# Altium project MecaVac.PrjPcb
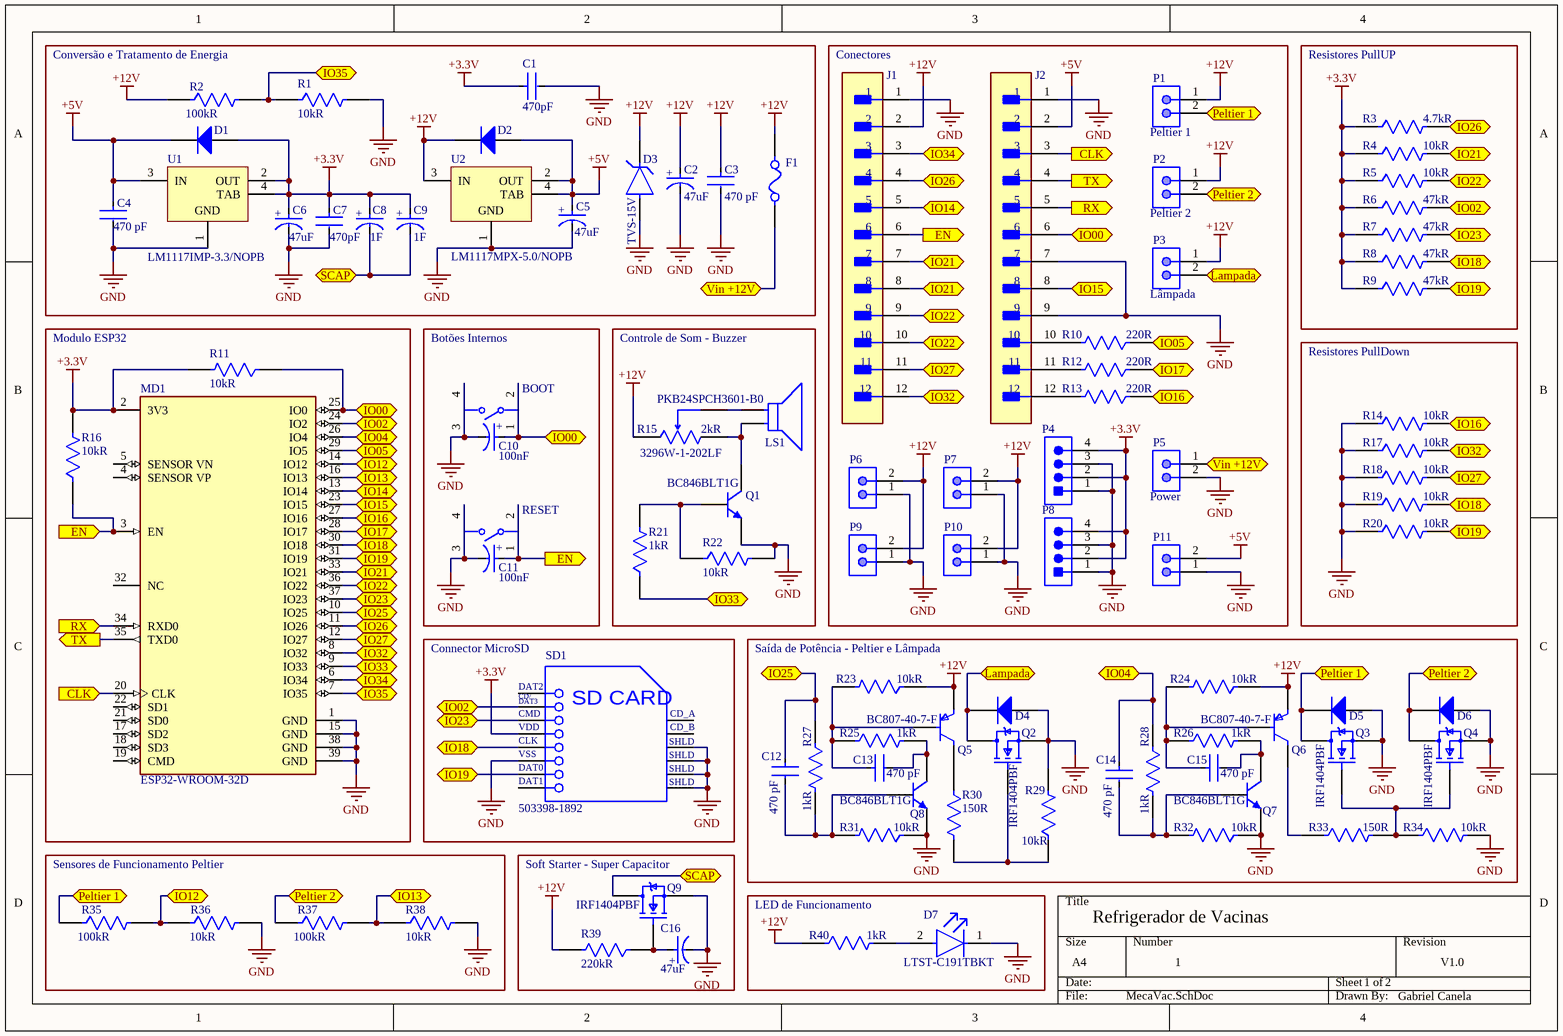
[diagram p0: MecaVac.SchDoc]
Designer: Gabriel Canela; File: MecaVac/main.SchDoc; Start Date: 03/11/2022
1 sheet, 93 parts. Net scope: flat (ports and power ports of the same name join across sheets).
Board file: MecaVac.PcbDoc

## Sheet MecaVac.SchDoc: Refrigerador de Vacinas
size A4; Date: 03/11/2022; Author: Gabriel Canela; CompanyName: Mecatron; DrawnBy: Gabriel Canela; DocumentNumber: 1; Revision: V1.0; SheetNumber: 1; SheetTotal: 2; SPICEModelCacheOFBBGRMV: <root> / <DocumentId>OFBBGRMV</DocumentId> / </root>; Power: Conversão e Tratamento de Energia; CPU: Modulo ESP32; potencia: Saída de Potência - Peltier e Lâmpada; Buzzer: Controle de Som - Buzzer; botoes: Botões Internos; Corrente: Sensores de Funcionamento Peltier; SD: Connector MicroSD; Conectores: Conectores; ResPullUp: Resistores PullUP; ResPullDown: Resistores PullDown; LED: LED de Funcionamento; SuperCorrente: Soft Starter - Super Capacitor

### Parts
C1  Capacitancia: 470pF  [FP-C0603C-CF-MFG]  (hidden comment: C0603C471J5GACTU)
C2  Capacitance: 47uF  [FP-T491D476K025AT-MFG]  (hidden comment: T491D476K025AT)
C3  Capacitance: 470 pF  [FP-C0603C-CF-MFG]  (hidden comment: C0603C471J5GACTU)
C4  Capacitance: 470 pF  [FP-C0603C-CF-MFG]  (hidden comment: C0603C471J5GACTU)
C5  47uF  [FP-TAJD-MFG]
C6  47uF  [FP-TAJD-MFG]
C7  Capacitancia: 470pF  [FP-C0603C-CF-MFG]  (hidden comment: C0603C471J5GACTU)
C8  value 1F  [FP-FR0H105ZF-MFG]  (hidden comment: Super Capacitor 1F 5.5V)
C9  1F  [FP-FR0H105ZF-MFG]
C10  Capacitance: 100nF  [FP-TAJA-MFG]  (hidden comment: TAJA104K035RNJ)
C11  Capacitance: 100nF  [FP-TAJA-MFG]  (hidden comment: TAJA104K035RNJ)
C12  Capacitance: 470 pF  [FP-C0603C-CF-MFG]  (hidden comment: C0603C471J5GACTU)
C13  Capacitance: 470 pF  [FP-C0603C-CF-MFG]  (hidden comment: C0603C471J5GACTU)
C14  Capacitance: 470 pF  [FP-C0603C-CF-MFG]  (hidden comment: C0603C471J5GACTU)
C15  Capacitance: 470 pF  [FP-C0603C-CF-MFG]  (hidden comment: C0603C471J5GACTU)
C16  Capacitance: 47uF  [FP-T491D476K025AT-MFG]  (hidden comment: T491D476K025AT)
D1  BAT54HT1G  [ONSC-SOD-323-2-477-02_V]  (value not drawn)
D2  BAT54HT1G  [ONSC-SOD-323-2-477-02_V]  (value not drawn)
D3  TVS-15V  [FP-95401-MFG]
D4  BAT54HT1G  [ONSC-SOD-323-2-477-02_V]  (value not drawn)
D5  BAT54HT1G  [ONSC-SOD-323-2-477-02_V]  (value not drawn)
D6  BAT54HT1G  [ONSC-SOD-323-2-477-02_V]  (value not drawn)
D7  LTST-C191TBKT  [FP-LTST-C191TBKT-MFG]
F1  64600001223  [FP-64600001223-MFG]  (value not drawn)
J1  22-27-2121  [FP-22-27-2121-MFG]  (value not drawn)
J2  22-27-2121  [FP-22-27-2121-MFG]  (value not drawn)
LS1  PKB24SPCH3601-B0  [FP-PKB24SPCH3601-B0-MFG]
MD1  ESP32-WROOM-32D  [FP-ESP32-WROOM-32D-MFG]
P1  Peltier 1  [PHOE-1803426_V]
P2  Peltier 2  [PHOE-1803426_V]
P3  Lâmpada  [PHOE-1803426_V]
P4  22-27-2041  [MOLX-22-27-2041_V]  (value not drawn)
P5  Power  [PHOE-1803426_V]
P6  22-27-2021  [MOLX-22-27-2021_V]  (value not drawn)
P7  22-27-2021  [MOLX-22-27-2021_V]  (value not drawn)
P8  22-27-2041  [MOLX-22-27-2041_V]  (value not drawn)
P9  22-27-2021  [MOLX-22-27-2021_V]  (value not drawn)
P10  22-27-2021  [MOLX-22-27-2021_V]  (value not drawn)
P11  22-27-2021  [MOLX-22-27-2021_V]  (value not drawn)
Q1  BC846BLT1G  [ONSC-SOT-23-3-318-08_V]
Q2  IRF1404PBF  [FP-PG-TO220-3-MFG]
Q3  IRF1404PBF  [FP-PG-TO220-3-MFG]
Q4  IRF1404PBF  [FP-PG-TO220-3-MFG]
Q5  BC807-40-7-F  [FP-SOT23-MFG]
Q6  BC807-40-7-F  [FP-SOT23-MFG]
Q7  BC846BLT1G  [ONSC-SOT-23-3-318-08_V]
Q8  BC846BLT1G  [ONSC-SOT-23-3-318-08_V]
Q9  IRF1404PBF  [FP-PG-TO220-3-MFG]
R1  Resistance: 10kR  [FP-CRCW0805-e3-IPC_A]  (hidden comment: CRCW080510K0FKEA)
R2  Resistance: 100kR  [FP-CRCW0805-e3-MFG]  (hidden comment: CRCW0805100KFKEA)
R3  Resistance: 4.7kR  [FP-CRCW0805-e3-IPC_B]  (hidden comment: CRCW08054K70FKEA)
R4  Resistance: 10kR  [FP-CRCW0805-e3-IPC_A]  (hidden comment: CRCW080510K0FKEA)
R5  Resistance: 10kR  [FP-CRCW0805-e3-IPC_A]  (hidden comment: CRCW080510K0FKEA)
R6  Resistance: 47kR  [FP-CRCW0805-e3-MFG]  (hidden comment: CRCW080547K0FKEA)
R7  Resistance: 47kR  [FP-CRCW0805-e3-MFG]  (hidden comment: CRCW080547K0FKEA)
R8  Resistance: 47kR  [FP-CRCW0805-e3-MFG]  (hidden comment: CRCW080547K0FKEA)
R9  Resistance: 47kR  [FP-CRCW0805-e3-MFG]  (hidden comment: CRCW080547K0FKEA)
R10  Resistance: 220R  [FP-CRCW0805-e3-MFG]  (hidden comment: CRCW0805220RFKEA)
R11  Resistance: 10kR  [FP-CRCW0805-e3-IPC_A]  (hidden comment: CRCW080510K0FKEA)
R12  Resistance: 220R  [FP-CRCW0805-e3-MFG]  (hidden comment: CRCW0805220RFKEA)
R13  Resistance: 220R  [FP-CRCW0805-e3-MFG]  (hidden comment: CRCW0805220RFKEA)
R14  Resistance: 10kR  [FP-CRCW0805-e3-IPC_A]  (hidden comment: CRCW080510K0FKEA)
R15  3296W-1-202LF  Resistance: 2kR  [FP-3296W-MFG]
R16  Resistance: 10kR  [FP-CRCW0805-e3-IPC_A]  (hidden comment: CRCW080510K0FKEA)
R17  Resistance: 10kR  [FP-CRCW0805-e3-IPC_A]  (hidden comment: CRCW080510K0FKEA)
R18  Resistance: 10kR  [FP-CRCW0805-e3-IPC_A]  (hidden comment: CRCW080510K0FKEA)
R19  Resistance: 10kR  [FP-CRCW0805-e3-IPC_A]  (hidden comment: CRCW080510K0FKEA)
R20  Resistance: 10kR  [FP-CRCW0805-e3-IPC_A]  (hidden comment: CRCW080510K0FKEA)
R21  Resistance: 1kR  [FP-ERA6A-IPC_C]  (hidden comment: ERA6AEB102V)
R22  Resistance: 10kR  [FP-CRCW0805-e3-IPC_A]  (hidden comment: CRCW080510K0FKEA)
R23  Resistance: 10kR  [FP-CRCW0805-e3-IPC_A]  (hidden comment: CRCW080510K0FKEA)
R24  Resistance: 10kR  [FP-CRCW0805-e3-IPC_A]  (hidden comment: CRCW080510K0FKEA)
R25  Resistance: 1kR  [FP-ERA6A-IPC_C]  (hidden comment: ERA6AEB102V)
R26  Resistance: 1kR  [FP-ERA6A-IPC_C]  (hidden comment: ERA6AEB102V)
R27  Resistance: 1kR  [FP-ERA6A-IPC_C]  (hidden comment: ERA6AEB102V)
R28  Resistance: 1kR  [FP-ERA6A-IPC_C]  (hidden comment: ERA6AEB102V)
R29  Resistance: 10kR  [FP-CRCW0805-e3-IPC_A]  (hidden comment: CRCW080510K0FKEA)
R30  Resistance: 150R  [FP-ERJ6GE-MFG]  (hidden comment: ERJ-6GEYJ151V)
R31  Resistance: 10kR  [FP-CRCW0805-e3-IPC_A]  (hidden comment: CRCW080510K0FKEA)
R32  Resistance: 10kR  [FP-CRCW0805-e3-IPC_A]  (hidden comment: CRCW080510K0FKEA)
R33  Resistance: 150R  [FP-ERJ6GE-MFG]  (hidden comment: ERJ-6GEYJ151V)
R34  Resistance: 10kR  [FP-CRCW0805-e3-IPC_A]  (hidden comment: CRCW080510K0FKEA)
R35  Resistance: 100kR  [FP-CRCW0805-e3-MFG]  (hidden comment: CRCW0805100KFKEA)
R36  Resistance: 10kR  [FP-CRCW0805-e3-IPC_A]  (hidden comment: CRCW080510K0FKEA)
R37  Resistance: 100kR  [FP-CRCW0805-e3-MFG]  (hidden comment: CRCW0805100KFKEA)
R38  Resistance: 10kR  [FP-CRCW0805-e3-IPC_A]  (hidden comment: CRCW080510K0FKEA)
R39  Resistance: 220kR  [FP-CRCW0805-e3-IPC_C]  (hidden comment: CRCW0805220KFKEA)
R40  Resistance: 1kR  [FP-ERA6A-IPC_C]  (hidden comment: ERA6AEB102V)
SD1  503398-1892  [MOLX-503398-1892_V]
SW1  BOOT  [FP-B3S-1000P-MFG]
SW2  RESET  [FP-B3S-1000P-MFG]
U1  LM1117IMP-3.3/NOPB  [DCY0004A_N]
U2  LM1117MPX-5.0/NOPB  [DCY0004A_L]

### Ports
CLK (in, see MecaVac NEW[1C], MecaVac NEW[3A], MecaVac[3A]), CLK (out, see MecaVac NEW[1C], MecaVac NEW[3A], MecaVac[1C]), EN (in, see MecaVac NEW[1C], MecaVac NEW[2C], MecaVac NEW[3A], MecaVac[2C], MecaVac[3A]), EN (out, see MecaVac NEW[1C], MecaVac NEW[2C], MecaVac NEW[3A], MecaVac[1C], MecaVac[2C]), EN (out, see MecaVac NEW[1C], MecaVac NEW[2C], MecaVac NEW[3A], MecaVac[1C], MecaVac[3A]), IO00 (bidir, see MecaVac NEW[1B], MecaVac NEW[2B], MecaVac NEW[3A], MecaVac[1B], MecaVac[2B]), IO00 (bidir, see MecaVac NEW[1B], MecaVac NEW[2B], MecaVac NEW[3A], MecaVac[1B], MecaVac[3A]), IO00 (bidir, see MecaVac NEW[1B], MecaVac NEW[2B], MecaVac NEW[3A], MecaVac[2B], MecaVac[3A]), IO02 (bidir, see MecaVac NEW[1B], MecaVac NEW[2C], MecaVac NEW[4A], MecaVac[1B], MecaVac[2C]), IO02 (bidir, see MecaVac NEW[1B], MecaVac NEW[2C], MecaVac NEW[4A], MecaVac[1B], MecaVac[4A]), IO02 (bidir, see MecaVac NEW[1B], MecaVac NEW[2C], MecaVac NEW[4A], MecaVac[2C], MecaVac[4A]), IO04 (bidir, see MecaVac NEW[1B], MecaVac NEW[3D], MecaVac[1B]), IO04 (bidir, see MecaVac NEW[1B], MecaVac NEW[3D], MecaVac[3C]), IO05 (bidir, see MecaVac NEW[1B], MecaVac NEW[3B], MecaVac[1B]), IO05 (bidir, see MecaVac NEW[1B], MecaVac NEW[3B], MecaVac[3B]), IO12 (bidir, see MecaVac NEW[1B], MecaVac NEW[1D], MecaVac[1B]), IO12 (bidir, see MecaVac NEW[1B], MecaVac NEW[1D], MecaVac[1D]), IO13 (bidir, see MecaVac NEW[1B], MecaVac NEW[1D], MecaVac[1B]), IO13 (bidir, see MecaVac NEW[1B], MecaVac NEW[1D], MecaVac[1D]), IO14 (bidir, see MecaVac NEW[1B], MecaVac NEW[3A], MecaVac[1B]), IO14 (bidir, see MecaVac NEW[1B], MecaVac NEW[3A], MecaVac[3A]), IO15 (bidir, see MecaVac NEW[1B], MecaVac NEW[3B], MecaVac[1B]), IO15 (bidir, see MecaVac NEW[1B], MecaVac NEW[3B], MecaVac[3B]), IO16 (bidir, see MecaVac NEW[1C], MecaVac NEW[3B], MecaVac NEW[4B], MecaVac[1C], MecaVac[3B]), IO16 (bidir, see MecaVac NEW[1C], MecaVac NEW[3B], MecaVac NEW[4B], MecaVac[1C], MecaVac[4B]), IO16 (bidir, see MecaVac NEW[1C], MecaVac NEW[3B], MecaVac NEW[4B], MecaVac[3B], MecaVac[4B]), IO17 (bidir, see MecaVac NEW[1C], MecaVac NEW[3B], MecaVac[1C]), IO17 (bidir, see MecaVac NEW[1C], MecaVac NEW[3B], MecaVac[3B]), IO18 (bidir, see MecaVac NEW[1C], MecaVac NEW[2C], MecaVac NEW[4B], MecaVac[1C], MecaVac[2C], MecaVac[4B]), IO18 (bidir, see MecaVac NEW[1C], MecaVac NEW[2C], MecaVac NEW[4B], MecaVac[1C], MecaVac[4B]), IO18 (bidir, see MecaVac NEW[1C], MecaVac NEW[2C], MecaVac NEW[4B], MecaVac[2C], MecaVac[4B]), IO19 (bidir, see MecaVac NEW[1C], MecaVac NEW[2D], MecaVac NEW[4B], MecaVac NEW[4C], MecaVac[1C], MecaVac[2D], MecaVac[4B]), IO19 (bidir, see MecaVac NEW[1C], MecaVac NEW[2D], MecaVac NEW[4B], MecaVac NEW[4C], MecaVac[1C], MecaVac[2D], MecaVac[4C]), IO19 (bidir, see MecaVac NEW[1C], MecaVac NEW[2D], MecaVac NEW[4B], MecaVac NEW[4C], MecaVac[1C], MecaVac[4B], MecaVac[4C]), IO19 (bidir, see MecaVac NEW[1C], MecaVac NEW[2D], MecaVac NEW[4B], MecaVac NEW[4C], MecaVac[2D], MecaVac[4B], MecaVac[4C]), IO21 (bidir, see MecaVac NEW[1C], MecaVac NEW[3B], MecaVac NEW[4A], MecaVac NEW[5B], MecaVac[1C], MecaVac[3B]), IO21 (bidir, see MecaVac NEW[1C], MecaVac NEW[3B], MecaVac NEW[4A], MecaVac NEW[5B], MecaVac[1C], MecaVac[3B], MecaVac[4A]), IO21 (bidir, see MecaVac NEW[1C], MecaVac NEW[3B], MecaVac NEW[4A], MecaVac NEW[5B], MecaVac[3B], MecaVac[4A]), IO22 (bidir, see MecaVac NEW[1C], MecaVac NEW[3B], MecaVac NEW[4A], MecaVac NEW[5B], MecaVac[1C], MecaVac[3B]), IO22 (bidir, see MecaVac NEW[1C], MecaVac NEW[3B], MecaVac NEW[4A], MecaVac NEW[5B], MecaVac[1C], MecaVac[3B], MecaVac[4A]), IO22 (bidir, see MecaVac NEW[1C], MecaVac NEW[3B], MecaVac NEW[4A], MecaVac NEW[5B], MecaVac[3B], MecaVac[4A]), IO23 (bidir, see MecaVac NEW[1C], MecaVac NEW[2C], MecaVac NEW[4A], MecaVac[1C], MecaVac[2C]), IO23 (bidir, see MecaVac NEW[1C], MecaVac NEW[2C], MecaVac NEW[4A], MecaVac[1C], MecaVac[4A]), IO23 (bidir, see MecaVac NEW[1C], MecaVac NEW[2C], MecaVac NEW[4A], MecaVac[2C], MecaVac[4A]), IO25 (bidir, see MecaVac NEW[1C], MecaVac NEW[3C], MecaVac[1C]), IO25 (bidir, see MecaVac NEW[1C], MecaVac NEW[3C], MecaVac[2C]), IO26 (bidir, see MecaVac NEW[1C], MecaVac NEW[3A], MecaVac NEW[4A], MecaVac[1C], MecaVac[3A]), IO26 (bidir, see MecaVac NEW[1C], MecaVac NEW[3A], MecaVac NEW[4A], MecaVac[1C], MecaVac[4A]), IO26 (bidir, see MecaVac NEW[1C], MecaVac NEW[3A], MecaVac NEW[4A], MecaVac[3A], MecaVac[4A]), IO27 (bidir, see MecaVac NEW[1C], MecaVac NEW[3B], MecaVac NEW[4B], MecaVac[1C], MecaVac[3B]), IO27 (bidir, see MecaVac NEW[1C], MecaVac NEW[3B], MecaVac NEW[4B], MecaVac[1C], MecaVac[4B]), IO27 (bidir, see MecaVac NEW[1C], MecaVac NEW[3B], MecaVac NEW[4B], MecaVac[3B], MecaVac[4B]), IO32 (bidir, see MecaVac NEW[1C], MecaVac NEW[3B], MecaVac NEW[4B], MecaVac[1C], MecaVac[3B]), IO32 (bidir, see MecaVac NEW[1C], MecaVac NEW[3B], MecaVac NEW[4B], MecaVac[1C], MecaVac[4B]), IO32 (bidir, see MecaVac NEW[1C], MecaVac NEW[3B], MecaVac NEW[4B], MecaVac[3B], MecaVac[4B]), IO33 (bidir, see MecaVac NEW[1C], MecaVac NEW[2C], MecaVac[1C]), IO33 (bidir, see MecaVac NEW[1C], MecaVac NEW[2C], MecaVac[2C]), IO34 (bidir, see MecaVac NEW[1C], MecaVac NEW[3A], MecaVac[1C]), IO34 (bidir, see MecaVac NEW[1C], MecaVac NEW[3A], MecaVac[3A]), IO35 (bidir, see MecaVac NEW[1A], MecaVac NEW[1C], MecaVac[1A]), IO35 (bidir, see MecaVac NEW[1A], MecaVac NEW[1C], MecaVac[1C]), Lampada (bidir, see MecaVac NEW[4B], MecaVac NEW[4C], MecaVac[3C]), Lampada (bidir, see MecaVac NEW[4B], MecaVac NEW[4C], MecaVac[4B]), Peltier 1 (bidir, see MecaVac NEW[1D], MecaVac NEW[4A], MecaVac NEW[4C], MecaVac[1D], MecaVac[4A]), Peltier 1 (bidir, see MecaVac NEW[1D], MecaVac NEW[4A], MecaVac NEW[4C], MecaVac[1D], MecaVac[4C]), Peltier 1 (bidir, see MecaVac NEW[1D], MecaVac NEW[4A], MecaVac NEW[4C], MecaVac[4A], MecaVac[4C]), Peltier 2 (bidir, see MecaVac NEW[1D], MecaVac NEW[4A], MecaVac NEW[4C], MecaVac[1D], MecaVac[4A]), Peltier 2 (bidir, see MecaVac NEW[1D], MecaVac NEW[4A], MecaVac NEW[4C], MecaVac[1D], MecaVac[4C]), Peltier 2 (bidir, see MecaVac NEW[1D], MecaVac NEW[4A], MecaVac NEW[4C], MecaVac[4A], MecaVac[4C]), RX (in, see MecaVac NEW[1C], MecaVac NEW[3A], MecaVac[3A]), RX (out, see MecaVac NEW[1C], MecaVac NEW[3A], MecaVac[1C]), SCAP (bidir, see MecaVac NEW[1B], MecaVac NEW[2D], MecaVac[1B]), SCAP (bidir, see MecaVac NEW[1B], MecaVac NEW[2D], MecaVac[2D]), TX (out, see MecaVac NEW[1C], MecaVac NEW[3A], MecaVac[1C]), TX (out, see MecaVac NEW[1C], MecaVac NEW[3A], MecaVac[3A]), Vin +12V (bidir, see MecaVac NEW[2B], MecaVac NEW[4B], MecaVac[2B]), Vin +12V (bidir, see MecaVac NEW[2B], MecaVac NEW[4B], MecaVac[4B])

### Nets
+3.3V: C1.1 C6.2(A) C7.1 C8.2(A) C9.2(A) D1.2(A) MD1.2(3V3) P4.2 P4.4 P8.2 P8.4 R3.1 R4.1 R5.1 R6.1 R7.1 R8.1 R9.1 R11.2 R16.2 SD1.4(VDD) U1.2(OUT) U1.4(TAB)
+5V: C4.1 C5.2(A) D1.1(K) D2.2(A) J2.2 P11.2 U1.3(IN) U2.2(OUT) U2.4(TAB)
+12V: C2.2(A) C3.1 D2.1(K) D3.1(C) F1.2 J1.2 P1.1 P2.1 P3.1 P6.2 P7.2 P9.2 P10.2 Q5.2(E) Q6.2(E) R2.1 R15.1(CCW) R23.1 R24.1 R39.2 R40.1 U2.3(IN)
GND: C1.2 C2.1(C) C3.2 C4.2 C5.1(C) C6.1(C) C7.2 C10.1(C) C11.1(C) C16.1(C) D3.2(A) D4.2(A) D5.2(A) D6.2(A) D7.1(C) J1.1 J2.1 J2.7 J2.9 MD1.1(GND) MD1.15(GND) MD1.38(GND) MD1.39(GND) P4.1 P4.3 P5.2 P6.1 P7.1 P8.1 P8.3 P9.1 P10.1 P11.1 Q1.2(E) Q2.3(SOURCE) Q3.3(SOURCE) Q4.3(SOURCE) Q7.2(E) Q8.2(E) Q9.3(SOURCE) R1.2 R14.1 R17.1 R18.1 R19.1 R20.1 R22.2 R29.2 R31.1 R32.1 R34.2 R36.2 R38.2 SD1.6(VSS) SD1.11(SHLD) SD1.12(SHLD) SD1.13(SHLD) SD1.14(SHLD) SW1.3 SW1.4 SW2.3 SW2.4 U1.1(GND) U2.1(GND)
NetC8_1: C8.1(C) C9.1(C) Q9.2(DRAIN) ; port SCAP
NetC10_2: C10.2(A) J2.6 MD1.25(IO0) R11.1 SW1.1 SW1.2 ; port IO00
NetC11_2: C11.2(A) J1.6 MD1.3(EN) R16.1 SW2.1 SW2.2 ; port EN
NetC12_1: C12.1 MD1.10(IO25) R27.1 ; port IO25
NetC12_2: C12.2 Q8.1(B) R27.2 R31.2
NetC13_1: C13.1 Q5.1(B) R23.2 R25.1
NetC13_2: C13.2 Q8.3(C) R25.2
NetC14_1: C14.1 MD1.26(IO4) R28.1 ; port IO04
NetC14_2: C14.2 Q7.1(B) R28.2 R32.2
NetC15_1: C15.1 Q6.1(B) R24.2 R26.1
NetC15_2: C15.2 Q7.3(C) R26.2
NetC16_2: C16.2(A) Q9.1(GATE) R39.1
NetD4_1: D4.1(K) P3.2 Q2.2(DRAIN) ; port Lampada
NetD5_1: D5.1(K) P1.2 Q3.2(DRAIN) R35.1 ; port Peltier 1
NetD6_1: D6.1(K) P2.2 Q4.2(DRAIN) R37.1 ; port Peltier 2
NetD7_2: D7.2(A) R40.2
NetF1_1: F1.1 P5.1 ; port Vin +12V
NetJ1_3: J1.3 MD1.6(IO34) ; port IO34
NetJ1_4: J1.4 MD1.11(IO26) R3.2 ; port IO26
NetJ1_5: J1.5 MD1.13(IO14) ; port IO14
NetJ1_7: J1.7 J1.8 MD1.33(IO21) R4.2 ; port IO21
NetJ1_9: J1.9 J1.10 MD1.36(IO22) R5.2 ; port IO22
NetJ1_11: J1.11 MD1.12(IO27) R18.2 ; port IO27
NetJ1_12: J1.12 MD1.8(IO32) R17.2 ; port IO32
NetJ2_3: J2.3 MD1.20(CLK) ; port CLK
NetJ2_4: J2.4 MD1.35(TXD0) ; port TX
NetJ2_5: J2.5 MD1.34(RXD0) ; port RX
NetJ2_8: J2.8 MD1.23(IO15) ; port IO15
NetJ2_10: J2.10 R10.2
NetJ2_11: J2.11 R12.2
NetJ2_12: J2.12 R13.2
NetLS1_1: LS1.1(C) Q1.3(C) R15.3(CW)
NetLS1_2: LS1.2(A) R15.2(WIPER)
NetMD1_7: MD1.7(IO35) R1.1 R2.2 ; port IO35
NetMD1_9: MD1.9(IO33) R21.1 ; port IO33
NetMD1_14: MD1.14(IO12) R35.2 R36.1 ; port IO12
NetMD1_16: MD1.16(IO13) R37.2 R38.1 ; port IO13
NetMD1_24: MD1.24(IO2) R6.2 SD1.2(CD/DAT3) ; port IO02
NetMD1_27: MD1.27(IO16) R13.1 R14.2 ; port IO16
NetMD1_28: MD1.28(IO17) R12.1 ; port IO17
NetMD1_29: MD1.29(IO5) R10.1 ; port IO05
NetMD1_30: MD1.30(IO18) R8.2 R19.2 SD1.5(CLK) ; port IO18
NetMD1_31: MD1.31(IO19) R9.2 R20.2 SD1.7(DAT0) ; port IO19
NetMD1_37: MD1.37(IO23) R7.2 SD1.3(CMD) ; port IO23
NetQ1_1: Q1.1(B) R21.2 R22.1
NetQ2_1: Q2.1(GATE) R29.1 R30.2
NetQ3_1: Q3.1(GATE) Q4.1(GATE) R33.2 R34.1
NetQ5_3: Q5.3(C) R30.1
NetQ6_3: Q6.3(C) R33.1

Not connected (* = marked no-connect by the designer): MD1 4(SENSOR_VP) 5(SENSOR_VN) 17(SD2) 18(SD3) 19(CMD) 21(SD0) 22(SD1) 32(NC); SD1 1(DAT2) 8(DAT1) 9(CD_A) 10(CD_B)

### Notes on the sheet
- (in symbol CMP-2000-05621-1) CD/; DAT3; SD CARD
- (in symbol CMP-03017-000020-1) +
- (in symbol CMP-03024-000003-1) +
- (in symbol CMP-04424-000452-1) +
- (in symbol CMP-04424-000673-1) +

### Library data of the parts
C1 C3 C4 C7 C12-C15 = CMP-2006-03581-2: CAP CER 470PF 50V 5% NP0 0603; Manufacturer: KEMET; Tolerance: 0.05; Temperature Coefficient: 30ppm/°C; Temperature Characteristic: C0G; Automotive Grade: Grade 1; Material: Ceramic; Digikey Description: CAP CER 470PF 50V 5% NP0 0603; Device Class L2: Capacitors; Device Class L3: Ceramic Capacitors; RoHS: TRUE; Voltage Rating: 50 V; Height: 0.87mm; Value: 470 pF; Temperature Range Low: -55°C; Temperature Range High: +125°C; Package: C0603C-CF; Octopart: https://octopart.com/c0603c471j5gactu-kemet-95298; Temperature: -55°C to +125°C; Automotive: Yes; Lead Free: Yes; Manufacturer Part Number: C0603C471J5GACTU; ComponentLink2Description: Datasheet; Mouser Description: Ceramic Capacitor 470Pf 50V, C0G, 5%, 0603, Full Reel; Category: Cap; ComponentLink2URL: https://api.kemet.com/component-edge/download/datasheet/C0603C100J5GACAUTO.pdf; Device Class L1: Passive Components
  C1 C7: Capacitance: 470 pF
C2 C16 = CMP-03017-000020-1: CAP TANT 47UF 10% 25V 2917; Dielectric Material: Tantalum; Life (Hours): 2000Hour; Ripple Current: 463mA; Leakage Current: 11.8uA; Polarity: Polar; ESR (Equivalent Series Resistance): 700mR; Height - Seated (Max): 0.122inch; Package Quantity: 1; Max Operating Temperature: 125°C; Failure Rate: 0.001%; Height: 2.8mm; Voltage Rating (DC): 25V; Dissipation Factor: 10%; Mount: Surface Mount; Min Operating Temperature: -55°C; Packaging: Tape and Reel; Radiation Hardening: No; Case Code (Metric): 7343; Features: General Purpose; Voltage: 25V; Case/Package: 2917; Case Code (Imperial): 2917; Tolerance: 10%; Number of Pins: 2; Weight: 0.023634oz; REACH SVHC: No SVHC; RoHS Compliant: Yes; Length: 7.3mm; Depth: 4.3mm; Lead Free: Lead Free; Width: 4.3mm; Voltage Rating: 25V; Termination: SMD/SMT
C5 C6 = CMP-04424-000452-1: 47uF 10V  ±10% 400mΩ 2917  SMD Tantalum Capacitor; Polarity: Polar; ESR (Equivalent Series Resistance): 900mR; Dissipation Factor: 6%; Leakage Current: 6uA; Voltage Rating (DC): 10V; Package Quantity: 1; Case/Package: 2917; Lead Free: Lead Free; Construction: Flat; Min Operating Temperature: -55°C; Mount: Surface Mount; Dielectric Material: Tantalum; Case Code (Imperial): 2917; Max Operating Temperature: 125°C; Radiation Hardening: No; Case Code (Metric): 7343; Width: 0.169inch; Voltage: 10V; Depth: 4.3mm; RoHS Compliant: Yes; Length: 7.3mm; Series: TAJ; Number of Pins: 2; Tolerance: 10%; Termination: SMD/SMT; Height: 2.9mm; Height - Seated (Max): 0.122inch; Packaging: Tape and Reel; Features: General Purpose; Lead Pitch: 4.4mm; Capacitance: 47uF; REACH SVHC: No SVHC; Voltage Rating: 10V
C8 C9 = CMP-03024-000003-1: CAP 1F -20% +80% 5.5V T/H; Manufacturer: KEMET; Manufacturer Part Number: FR0H105ZF; Tolerance: -20/+80%; Digikey Description: CAP 1F -20% +80% 5.5V T/H; Device Class L1: Passive Components; Device Class L3: Supercapacitors; ComponentLink2URL: https://content.kemet.com/datasheets/KEM_S6016_FR.pdf; RoHS: TRUE; Mouser Description: Supercapacitors / Ultracapacitors 1F 5.5volts Radial Super Cap; Octopart: https://octopart.com/fr0h105zf-kemet-30531656; Voltage Rating: 5.5V; Device Class L2: Capacitors; Package: FR0H105ZF; Temperature: -40°C to +85°C; Temperature Range High: +85°C; Automotive: No; Capacitance: 1F; Temperature Range Low: -40°C; ComponentLink2Description: Datasheet; Category: Cap; Height: 22mm; Lead Free: Yes
  C9: Value: 1F
C10 C11 = CMP-04424-000673-1: 100nF 35V  ±10% 24Ω 1206  SMD Tantalum Capacitor; ESR (Equivalent Series Resistance): 24R; Dissipation Factor: 4%; Polarity: Polar; Leakage Current: 500nA; Q Factor: 4; Height - Seated (Max): 0.071inch; Construction: Flat; Voltage Rating: 35V; Tolerance: 10%; Case Code (Imperial): 1206; Number of Pins: 2; Radiation Hardening: No; Features: General Purpose; REACH SVHC: No SVHC; Voltage Rating (DC): 35V; Case/Package: 1206; Termination: SMD/SMT; Packaging: Tape and Reel; Length: 3.2mm; Min Operating Temperature: -55°C; Depth: 1.6mm; Width: 1.6mm; Height: 1.6mm; Mount: Surface Mount; Dielectric Material: Tantalum; Lead Pitch: 1.1mm; Lead Free: Lead Free; Voltage: 35V; RoHS Compliant: Yes; Max Operating Temperature: 125°C; Series: TAJ; Package Quantity: 1; Case Code (Metric): 3216
D1 D2 D4-D6 = CMP-1055-00462-1: Schottky Barrier Diode, 2-Pin SOD-323, Pb-Free, Tape and Reel; Manufacturer: On Semiconductor; Configuration: Single; trr Max (ns): 5; IFSM Max (A): 0.6; ComponentLink3URL: http://www.onsemi.com/pub_link/Collateral/477-02.PDF.1; PackageDescription: 2-Pin SOD, Body 1.7 x 1.25 mm; ComponentLink2URL: http://www.onsemi.cn/pub_link/Collateral/BAT54HT1-D.PDF; ComponentLink3Description: Package Specification; ComponentLink2Description: Datasheet; DatasheetVersion: Rev. 6; PackageReference: SOD-323-2-477-02; RoHS: TRUE; ComponentLink1URL: http://www.onsemi.com/; Packing: Tape and Reel; PartNumber: BAT54HT1G; Mounting Technology: Surface Mount; ComponentLink1Description: Manufacturer URL; PackageVersion: Rev. H, 03/2007
D3 = CMP-02577-000009-1: TVS DIODE 15V 24.4V DO214AA; Manufacturer Part Number: SMBJ15A-E3/52; Manufacturer: Vishay; Standoff Height: 0mm; Number Of Channels: 1; Max Junction Temp: +150°C; Breakdown Voltage: 16.7V; Peak Pulse Power: 600W; Peak Pulse Current: 24.6A; Direction: Unidirectional; Category: Diode; Reverse Standoff Voltage: 15V; Package: 95401; Temperature: -55°C to +150°C; Automotive: No; ComponentLink2Description: Datasheet; Temperature Range High: +150°C; ComponentLink2URL: https://www.vishay.com/docs/88392/smbj.pdf; Temperature Range Low: -55°C; Digikey Description: TVS DIODE 15V 24.4V DO214AA; Device Class L1: Circuit Protection; Mouser Description: TVS Diodes - Transient Voltage Suppressors 600W 15V 5% Uni; RoHS: TRUE; Device Class L2: TVS Diodes; Footprint Url: https://www.vishay.com/docs/95401/smb.pdf; Clamping Voltage: 24.4V; Octopart: https://octopart.com/smbj15a-e3%2F52-vishay-39558613; Lead Free: Yes; Device Class L3: unset; Height: 2.44mm
D7 = CMP-22017-000008-1: LED BLUE CLEAR CHIP SMD; Lens Color: Colorless; Dominant Wavelength: 475nm; Forward Current: 20mA; Wavelength: 468nm; Viewing Angle: 130°; Power Dissipation: 76mW; Luminous Intensity: 180mcd; Reverse Voltage: 5V; Number of Elements: 1; Lens Style: Diffused; Forward Voltage: 3.8V; Max Power Dissipation: 75mW; Case Code (Metric): 1608; Packaging: Tape and Reel; Case/Package: 0603; Depth: 1.6mm; Mount: Surface Mount; Lead Free: Lead Free; Min Operating Temperature: -20°C; Lens Transparency: Clear; Illumination Color: Blue; Height: 0.55mm; Test Current: 20mA; Case Code (Imperial): 0603; Max Operating Temperature: 80°C; Number of Pins: 2; Length: 0.8mm; Radiation Hardening: No; Package Quantity: 1; Number of LEDs: 1; Width: 0.8mm; Color: Blue
F1 = CMP-08604-000020-1: FUSE BLOCK CART 250V 6.3A PCB; Manufacturer: Littelfuse Inc; Number Of Fuses: 1; Conn Orientation: Horizontal; ComponentLink2URL: https://www.littelfuse.com/~/media/electronics/datasheets/fuse_blocks/littelfuse_fuse_block_646_datasheet.pdf.pdf; Manufacturer Part Number: 64600001223; Mouser Description: Fuse Holder Screw Mount Bulk; Voltage Rating Ac: 250V; Voltage Rating Dc: 250V; Category: Fuse; Fuse Current: 6.3A; Octopart: https://octopart.com/64600001223-littelfuse-39645661; Package: 0; Automotive: No; Height: 12mm; Device Class L3: unset; ComponentLink2Description: Datasheet; Digikey Description: FUSE BLOCK CART 250V 6.3A PCB; Device Class L1: Circuit Protection; Lead Free: Yes; Device Class L2: Fuse Holders; RoHS: TRUE
J1 J2 = CMP-04776-000649-1: CONN HEADER VERT 12POS 2.54MM; Insulation Resistance: 50GR; Number of Contacts: 12; Contact Resistance: 10mR; Voltage Rating (AC): 250V; Current Rating: 4A; Number of Lines: 1; Glow Wire Compliant: Non-compliant; Hole Diameter: 1.02mm; Gender: Male; Connector Type: Male Pin; Number of Rows: 1; Radiation Hardening: No; Max Operating Temperature: 75°C; Series: KK; Number of Poles: 12; Packaging: Bulk; Fastening Type: Friction; Package Quantity: 10; Voltage Rating (DC): 250V; Contact Mating Length: 0.295inch; Pitch: 2.54mm; Number of Positions: 12; Contact Material: Brass; Halogen Free: Low Halogen; RoHS Compliant: Yes; Orientation: Straight; Termination: Solder; Mount: Through Hole; Working Voltage: 250V; Lead Free: Lead Free; Housing Material: Nylon; Number of Circuits: 12; Contact Type: Male Pin; Flammability Rating: UL94 V-0; Voltage Rating: 250V; Contact Plating: Tin; Housing Color: White; Length: 30.48mm; Height: 11.7mm; Depth: 5.8mm; Material: Nylon; Color: Natural; Contact Gender: Male; Min Operating Temperature: 0°C; Lead Pitch: 2.54mm
LS1 = CMP-06203-000001-2: AUDIO PIEZO TRANSDUCER 3-15V TH; Self Resonant Frequency: 3.6kHz; Voltage Rating (DC): 15V; Min Supply Voltage: 3V; Operating Supply Current: 16mA; Voltage Rating: 12V; Max Frequency: 4.1kHz; Washable: No; REACH SVHC: No SVHC; Packaging: Bulk; Frequency: 3.6kHz; Max Operating Temperature: 70°C; Max Supply Voltage: 15V; Max Supply Voltage (DC): 15V; Diameter: 24.3mm; Lead Free: Lead Free; Radiation Hardening: No; Nominal Supply Current: 16mA; Height: 9.7mm; Mount: Flush; Nominal Supply Voltage (DC): 12V; Min Operating Temperature: -20°C; Termination: PC Pins; Length: 24.3mm; Package Quantity: 650; Min Supply Voltage (DC): 3V; Max Supply Current: 16mA
MD1 = CMP-194065-000003-1: WIFI MODULE 32MBITS SPI FLASH; Manufacturer: Espressif Systems; Max Supply Voltage: 3.6V; Nominal Supply Current: 500mA; Max Frequency: 2484MHz; Number Of Adc Channels: 16; Number Of Gpio: 32; Interface: I2C,SPI,UART,Ethernet,I2S,Other; Data Rate: 150Mbits/s; Min Supply Voltage: 3V; Bandwidth: 72MHz; Sensitivity: -98dBm; Octopart: https://octopart.com/esp32-wroom-32d-espressif+systems-91040050; Package: ESP32-WROOM-32D; ComponentLink2URL: https://www.espressif.com/sites/default/files/documentation/esp32-wroom-32d_esp32-wroom-32u_datasheet_en.pdf; Lead Free: Yes; Category: UNK; Mouser Description: Wi-Fi/BT BLE Module ESP32-D0WD, SPI Flash, UART, P; Device Class L1: Integrated Circuits (ICs); RoHS: TRUE; Temperature Range Low: -40°C; ComponentLink2Description: Datasheet; Digikey Description: WIFI MODULE 32MBITS SPI FLASH; Height: 3.2mm; Temperature: -40°C to +85°C; Manufacturer Part Number: ESP32-WROOM-32D; Device Class L3: Transceivers; Device Class L2: RF Semiconductors and Devices; Temperature Range High: +85°C; Automotive: No
P1-P3 P5 = CMP-2000-05826-1: Male Header, Pitch 3.81 mm, 1 x 2 Position, Height 9.2 mm, Tail Length 3.4 mm; Manufacturer: Phoenix Contact; Manufacturer URL: http://www.phoenixcontact.com/; Datasheet Version: 02/2015; Mounting Technology: ThroughHole; Package Description: Male Header, Pitch 3.81 mm, 1 x 2 Position, Height 9.2 mm; Datasheet URL: https://www.phoenixcontact.com/online/portal/cn/pxc/product_detail_page/!ut/p/b1/3VfHjrNIGHyWeQDG5HAkm5zjxQIM2AQDNvnp1zNa7WFX889l5YPpA6L1qUtVdFX3d4gPEYCiFAaBJHgID_Etma9lMl67W9J8fcf4iRJ1HIRRHAIZDANpTKVtR3IFAyUOwSEE0ZNTbb2iOquuOqg8OKsEReRD0XpT8cAJtHK1h62gd5Lwwj7fSR7gfNZiWNE2tu2Xg71pvaHw3VHbDIccysUbixteZxggMWJnxWgP9KIolKko13HrKNI0OD69xjcsLwZb9oJmcNi4flh1xw9LW6-eWTQ9nREGMg82nQ7i5d6Jdk07dw7fZbrokLagaoyYggEvB4C7H5W4HERjSAam7I1pSvC1iqzSu8itk8CidtE6n3bP2nD0Pp6iRD-LQiLob5pFzwLixwIWO7iH0PcgleukhedgldkYbrFLA5WSM7ufG5_qGPkUc9vEzZQaS901mlWkPYn5tWxhabkCUfW4SsSIbpPuMIJHpQReslhERyEnqVrZBIU1V5Nilrs5X123FVtC3BVOSLHMP1b6PfXsNSgk1T-F50SEmtzqQUXqhsW5rwQ1o0BXB2gELrcQ4gCUoNAFTBX6N2LEmxJz0Hclhr8rsXf1mPOuHoPf1WPwu3oMflePSW-7Fd81PGj4i1jqc2r6kGnO3K4b7QxsE14hAduG8C7FaT2GvZ7I-s0j05SGAI1kaO9y99Mt55acg9cLDNYaWwQcdDTPAtjrfMY1OBkOcVEr9HZ8tGspIQLbIVDtpjctgzHFMG4BAZsGvQthBBH4WA-nFo17BJ08nhvnnSIvtClxxDZLZLDt43EXgXAD-FUl6xp1LReX8w3Sb-3dEFiLergsTPmiPWlKHKTnUE9MvjMWis8MoKAxhXcLRQoyR1OjaJFnuS2q9AQSlWi71_PQS1I7hwNcTAR9vGjIY_k4yIf4mrafS9Z-gp_9mn329-4; Package Reference: 1803426
P4 P8 = CMP-2000-05243-1: Male Header, Pitch 2.54 mm, 1 x 4 Position, Height 11.7 mm, Tail Length 3.56 mm, RoHS, Bulk; Manufacturer: Molex; Voltage rating: 250V; Current rating: 4A; Datasheet Version: Rev. F, 06/2009; Operating temperature: 0degCto+75degC; Contact material: Tinplatedbrass; Manufacturer URL: http://www.molex.com/; Housing material: Nylon(UL94V-0); Datasheet URL: http://www.molex.com/pdm_docs/sd/022272041_sd.pdf
P6 P7 P9-P11 = CMP-2000-05537-1: Male Header, Pitch 2.54 mm, 1 x 2 Position, Height 11.7 mm, Tail Length 3.56 mm, 0 to 75 degC, RoHS, Bulk; Manufacturer: Molex; PartNumber: 0022272021; Current rating: 4A; Package Version: Rev. BC, 02/2012; Voltage rating: 250V; No. of Positions: 2; Pitch: 2.54mm; No. of Rows: 1; Orientation: Vertical; Operating temperature: 0°Cto+75°C; Manufacturer URL: http://www.molex.com/; Mounting Technology: ThroughHole; Housing material: Nylon(UL94V-0); Package Description: 2-Leads Header, Body 5.08 x 5.8 mm, Pitch 2.54 mm; Voltage - Max: 250V; Datasheet URL: http://www.molex.com/pdm_docs/sd/022272021_sd.pdf; Package Reference: 22-27-2021; Contact material: Tinplatedbrass; Current - Max: 4A; Datasheet Version: Rev. F, 06/2009
Q1 Q7 Q8 = CMP-1048-00779-1: General Purpose Transistor, NPN Silicon, 3-Pin SOT-23, Pb-Free, Tape and Reel; Manufacturer: On Semiconductor; fT Min (MHz): 100; IC Continuous (A): 0.1; Mounting Technology: Surface Mount; ComponentLink1Description: Manufacturer URL; ComponentLink2Description: Datasheet; Polarity: NPN; ComponentLink3URL: http://www.onsemi.cn/pub_link/Collateral/318-08.PDF; DatasheetVersion: Rev. 11; ComponentLink3Description: Package Specification; PartNumber: BC846BLT1G; RoHS: TRUE; PackageDescription: 3-Pin Small Outline Transistor, Body 2.92 x 1.3 mm, Pitch 0.95 mm; PackageReference: SOT-23-3-318-08; ComponentLink2URL: http://www.onsemi.cn/pub_link/Collateral/BC846ALT1-D.PDF; PackageVersion: Rev. AP, 11/2009; ComponentLink1URL: http://www.onsemi.com/; Packing: Tape and Reel
Q2-Q4 Q9 = CMP-32901-000149-1: MOSFET N-CH 40V 202A TO-220AB; Manufacturer: Infineon Technologies; Power Dissipation: 333W; Standoff Height: 3.37mm; Number Of Channels: 1; Depletion Mode: False; Turn On Delay Time: 17ns; Turn Off Delay Time: 46ns; Gate Charge At Vgs: 131nC @ 10V; Pulse Drain Current: 808A; Reverse Recovery Charge: 163nC; Gate To Source Voltage: 20V; Threshold Vgs Min: 2V; Max Junction Temp: +175°C; Max Forward Diode Voltage: 1.5V; Transconductance: 76S; Rthja Max: 62°C/W; Drain To Source Resistance: 0.0035Ω; Reverse Recovery Time: 78ns; Threshold Vgs Max: 4V; Input Capacitace At Vds: 5669pF @ 25V; Category: Trans; Temperature Range High: +175°C; Continuous Drain Current: 202A; Temperature Range Low: -55°C; Drain To Source Breakdown Voltage: 40V; Manufacturer Part Number: IRF1404PBF; Package: PG-TO220-3; ComponentLink2Description: Datasheet; Device Class L2: Transistors; Number Of N Channels: 1; Drain To Source Voltage: 40V; Temperature: -55°C to +175°C; Device Class L3: MOSFETs; Height: 19.8mm; Octopart: https://octopart.com/irf1404pbf-infineon-65873280; Automotive: No; Footprint Url: https://www.infineon.com/dgdl/po-to220ab-fp.pdf?fileId=5546d462580663ef0158068cfbee01be; RoHS: TRUE; ComponentLink2URL: https://www.infineon.com/dgdl/irf1404pbf.pdf?fileId=5546d462533600a4015355dae92618b0; Device Class L1: Discrete Semiconductors; Lead Free: Yes; Digikey Description: MOSFET N-CH 40V 202A TO-220AB
Q5 Q6 = CMP-12798-000025-1: TRANS PNP 45V 0.5A SOT23; Manufacturer: DIODES INC.; Gain Bandwidth Product: 100MHz; Hfe Testic: -100mA; Automotive Grade: Grade 0; Max Junction Temp: +150°C; Hfe Testvce: -1V; Collector Base Voltage: -50V; Collector Emitter Voltage: -45V; Hfe Min: 250; Power Dissipation: 310mW; Rthja Max: 403°C/W; Emitter Base Voltage: -5V; Collector Emitter Saturation Voltage: -0.7V; Hfe Max: 600; Number Of Pnp: 1; Max Collector Current: -0.5A; Standoff Height: 0.013mm; Height: 1.1mm; Octopart: https://octopart.com/bc807-40-7-f-diodes+inc.-354302; Temperature: -55°C to +150°C; Device Class L1: Discrete Semiconductors; Manufacturer Part Number: BC807-40-7-F; Digikey Description: TRANS PNP 45V 0.5A SOT23; Temperature Range High: +150°C; Mouser Description: Bipolar Transistors - BJT PNP BIPOLAR; Temperature Range Low: -55°C; Device Class L2: Transistors; Category: Trans; Device Class L3: BJTs; Automotive: Yes; Package: SOT23; ComponentLink2Description: Datasheet; Ipc Land Pattern Name: SOT92P240X102-3; ComponentLink2URL: https://www.diodes.com/assets/Datasheets/ds11208.pdf; RoHS: TRUE; Footprint Url: https://www.diodes.com/assets/Package-Files/SOT23.pdf; Number Of Elements: 1; Collector Emitter Breakdown Voltage: -45V; Lead Free: Yes
R1 R4 R5 R11 R14 R16-R20 R22-R24 R29 R31 R32 R34 R36 R38 = CMP-2001-04908-2: RES Thick Film, 10kΩ, 1%, 0.125W, 100ppm/°C, 0805; Voltage Rating (DC): 150V; Power Rating: 125mW; Weight: 0.000194oz; Package Quantity: 5000; Military Standard: Not; Max Operating Temperature: 155°C; Temperature Coefficient: 100ppm/°C; Contact Plating: Tin; Width: 1.25mm; Height: 0.45mm; Radiation Hardening: No; Tolerance: 1%; Min Operating Temperature: -55°C; Voltage Rating: 150V; Length: 2mm; Depth: 1.25mm; Termination: SMD/SMT; Packaging: Tape and Reel; Case/Package: 0805; Case Code (Metric): 2012; Lead Free: Lead Free; Case Code (Imperial): 0805; Composition: Thick Film
R2 R35 R37 = CMP-2001-04899-2: RES Thick Film, 100kΩ, 1%, 0.125W, 100ppm/°C, 0805; Power Rating: 125mW; Voltage Rating: 150V; Case/Package: 0805; Max Operating Temperature: 155°C; Case Code (Imperial): 0805; Lead Free: Lead Free; Weight: 0.000194oz; Number of Pins: 2; Package Quantity: 5000; Height: 0.45mm; Composition: Thick Film; Military Standard: Not; Tolerance: 1%; Case Code (Metric): 2012; Termination: SMD/SMT; Mount: Surface Mount; Radiation Hardening: No; Width: 1.25mm; Length: 2mm; Depth: 1.25mm; Packaging: Tape and Reel; Min Operating Temperature: -55°C; Contact Plating: Tin; Temperature Coefficient: 100ppm/°C; Voltage Rating (DC): 150V
R3 = CMP-2100-03615-2: RES Thick Film, 4.7kΩ, 1%, 0.125W, 100ppm/°C, 0805; Max Power Dissipation: 125mW; Voltage Rating: 150V; Termination: SMD/SMT; Weight: 0.000194oz; Case/Package: 0805; Number of Terminations: 2; Min Operating Temperature: -55°C; Case Code (Metric): 2012; Package Quantity: 10; Depth: 1.25mm; Military Standard: Not; Composition: Thick Film; Radiation Hardening: No; Contact Plating: Tin; Height: 0.45mm; Power Rating: 125mW; Features: Automotive AEC-Q200; Tolerance: 1%; Packaging: Tape and Reel; Max Operating Temperature: 155°C; Length: 2mm; Case Code (Imperial): 0805; Voltage Rating (DC): 150V; Width: 1.25mm; Temperature Coefficient: 100ppm/°C; Lead Free: Lead Free
R6-R9 = CMP-2001-03939-2: RES Thick Film, 47kΩ, 1%, 0.125W, 100ppm/°C, 0805; Voltage Rating: 150V; Max Power Dissipation: 125mW; Termination: SMD/SMT; Case Code (Imperial): 0805; Number of Terminations: 2; Contact Plating: Tin; Min Operating Temperature: -55°C; Features: Automotive AEC-Q200; Temperature Coefficient: 100ppm/°C; Case/Package: 0805; Composition: Thick Film; Working Voltage: 150V; Width: 1.25mm; Package Quantity: 10; Lead Free: Lead Free; Radiation Hardening: No; Power Rating: 125mW; Military Standard: Not; Height: 0.45mm; Weight: 0.000194oz; Length: 2mm; Depth: 1.25mm; Voltage Rating (DC): 150V; Packaging: Tape and Reel; Case Code (Metric): 2012; Max Operating Temperature: 155°C; Tolerance: 1%
R10 R12 R13 = CMP-2001-03682-2: RES Thick Film, 220Ω, 1%, 0.125W, 100ppm/°C, 0805; Max Power Dissipation: 125mW; Voltage Rating: 150V; Packaging: Tape and Reel; Termination: SMD/SMT; Height: 0.45mm; Package Quantity: 10; Width: 0.049inch; Min Operating Temperature: -55°C; Lead Free: Lead Free; Military Standard: Not; Mount: Surface Mount; Max Operating Temperature: 155°C; Voltage Rating (DC): 150V; Composition: Thick Film; Case/Package: 0805; Length: 2mm; Weight: 0.000194oz; Case Code (Metric): 2012; Number of Terminations: 2; Case Code (Imperial): 0805; Radiation Hardening: No; Tolerance: 1%; Features: Automotive AEC-Q200; Power Rating: 125mW; Depth: 1.25mm; Contact Plating: Tin; Temperature Coefficient: 100ppm/°C
R15 = CMP-2000-05582-2: TRIMMER 2K OHM 0.5W PC PIN TOP; Resistance Tolerance: 10%; Max Power Dissipation: 500mW; Number of Turns: 25; Temperature Coefficient: 100ppm/°C; Taper: Linear; Width: 9.53mm; Radiation Hardening: No; Length: 9.53mm; Packaging: Rail/Tube; Lead Free: Lead Free; Mount: Panel; Min Operating Temperature: -55°C; Power Rating: 500mW; RoHS Compliant: Yes; REACH SVHC: No SVHC; Color: Blue; Package Quantity: 50; Contact Plating: Tin; Weight: 0.03oz; Technology: CERMET; Max Operating Temperature: 125°C; Tolerance: 10%; Termination: Pin; Resistor Type: Cermet; Military Standard: Not; Height: 0.395inch; Series: 3296; Depth: 4.83mm
R21 R25-R28 R40 = CMP-2001-00581-2: RES 1K OHM 0.1% 1/8W 0805; Temperature Coefficient: 25ppm/°C; Working Voltage: 100V; Max Power Dissipation: 125mW; Height: 0.5mm; Technology: THIN FILM; REACH SVHC: No SVHC; Packaging: Tape and Reel; Length: 2mm; Width: 1.25mm; Resistance Tolerance: 0.1%; Series: ERA-6A; Resistor Type: Thin Film; Number of Pins: 2; Case Code (Metric): 2012; Voltage Rating: 100V; Radiation Hardening: No; Construction: Rectangular; Mount: Surface Mount; Number of Terminations: 2; Case/Package: 0805; Min Operating Temperature: -55°C; Military Standard: Not; RoHS Compliant: Yes; Termination: SMD/SMT; Case Code (Imperial): 0805; Depth: 1.25mm; Power Rating: 125mW; Max Operating Temperature: 155°C; Contact Plating: Tin; Package Quantity: 5000; Tolerance: 0.1%
R30 R33 = CMP-1013-00054-3: RES SMD 150 OHM 5% 1/8W 0805; Manufacturer: Panasonic; Temperature Coefficient: 200ppm/°C; Voltage Rating: 150V; Value: 150Ω; Power Rating: 0.125W; Automotive Grade: Grade 0; RoHS: TRUE; Series: ERJ; Tolerance: 5%; Height: 0.7mm; Device Class L1: Passive Components; Temperature Range Low: -55°C; Device Class L3: Chip SMD Resistors; Lead Free: Yes; Manufacturer Part Number: ERJ-6GEYJ151V; Composition: Thick Film; Temperature: -55°C to +155°C; Mouser Description: Thick Film Resistors - SMD 0805 150ohms 5% Tol; Footprint Url: https://industrial.panasonic.com/cdbs/www-data/pdf/RDA0000/DMA0000COL17.pdf; Device Class L2: Resistors; Category: Res; Ipc Land Pattern Name: RESC200125X60; Temperature Range High: +155°C; ComponentLink2URL: https://industrial.panasonic.com/ww/products/resistors/chip-resistors/general-purpose-chip-resistors/thick-film-chip-resistors/ERJ6GEYJ151V; Package: ERJ6GE; Digikey Description: RES SMD 150 OHM 5% 1/8W 0805; ComponentLink2Description: Datasheet; Octopart: https://octopart.com/erj-6geyj151v-panasonic-55422917; Automotive: Yes
R39 = CMP-1013-00772-3: RES Thick Film, 220kΩ, 1%, 0.125W, 100ppm/°C, 0805; Max Power Dissipation: 125mW; Voltage Rating: 150V; Max Operating Temperature: 155°C; Min Operating Temperature: -55°C; Termination: SMD/SMT; Temperature Coefficient: 100ppm/°C; Radiation Hardening: No; Number of Terminations: 2; Length: 2mm; Weight: 0.000194oz; Packaging: Tape and Reel; Case Code (Imperial): 0805; Case/Package: 0805; Military Standard: Not; Package Quantity: 10; Contact Plating: Tin; Power Rating: 125mW; Tolerance: 1%; Lead Free: Lead Free; Height: 0.45mm; Width: 1.25mm; Composition: Thick Film; Voltage Rating (DC): 150V; Features: Automotive AEC-Q200; Case Code (Metric): 2012; Depth: 1.25mm
SD1 = CMP-2000-05621-1: Micro SD Connector, Pitch 1.1 mm, 8 Position, Height 1.4 mm, -25 to 85 degC, RoHS, Tape and Reel; Manufacturer: Molex; Voltage Rating: 10VAC/DC; Current Rating: 500mA; Manufacturer URL: http://www.molex.com/; Package Reference: 503398-1892; Packaging: Reel; RoHS: Details; Brand: Molex; Datasheet URL: http://www.molex.com/pdm_docs/sd/5033981892_sd.pdf; Mounting Technology: SurfaceMount; Factory Pack Quantity: 2400; Datasheet Version: Rev. E, 04/2006; Series: 503398; Product Category: MemoryCardConnectors; Package Description: Micro SD Connector, Pitch 1.1 mm, 8 Position, Height 1.4 mm
SW1 SW2 = CMP-08834-000008-1: SWITCH TACTILE SPST-NO 0.05A 24V; Throw Configuration: SPST; Switch Function: Off-Mom; Switch Travel: 0.25mm; Contact Current Rating: 50mA; Actuator Length: 0.8mm; Mechanical Life: 500000Cycles; Contact Resistance: 100mR; Operating Force: 1.57N; Actuator Type: Standard; Illumination Type: Non-Illuminated; Ratings: IP67; Number of Poles: 1; Package Quantity: 1; Orientation: Straight; REACH SVHC: No SVHC; Lead Free: Lead Free; Max Current Rating: 50mA; Contact Plating: Silver; Current Rating: 50mA; Depth: 9mm; Contact Material: Bronze; Electrical Life: 500000Cycles; Termination: Gull Wing; Width: 6mm; Packaging: Tape and Reel; Min Operating Temperature: -25°C; Radiation Hardening: No; Max Voltage Rating (DC): 24V; Max Operating Temperature: 70°C; Length: 6.6mm; Height: 3.65mm; Voltage Rating (DC): 24V; Weight: 0.010582oz; Mount: Surface Mount
U1 = CMP-0062-01631-4: 800mA Low-Dropout Linear Regulator, 4-pin SOT-223, Pb-Free; Manufacturer: Texas Instruments; PackageTopMarking: XYTT*N05B; PowerWise: N; High-Reliability: Y; CompType: LDO IC; Code_IPC: SOT223-4; PackageReference: DCY0004A; PinCount: 4; PackageDescription: Molded SOT-223, 6.50 x 3.56 x 1.6mm Body, 4 Lead, 2.3mm Pitch; PartNumber: LM1117IMP-3.3/NOPB; RoHS: Y; ComponentLink1Description: Datasheet URL; Code_JEDEC: TO-261-AA; ComponentLink1URL: http://www.ti.com/general/docs/lit/getliterature.tsp?genericPartNumber=LM1117-N&fileType=pdf
U2 = CMP-0062-01635-4: 800mA Low-Dropout Linear Regulator, 4-pin SOT-223, Pb-Free; Manufacturer: Texas Instruments; PowerWise: N; High-Reliability: Y; PackageTopMarking: XYTT*N06A; CompType: LDO IC; PartNumber: LM1117MPX-5.0/NOPB; Code_JEDEC: TO-261-AA; Code_IPC: SOT223-4; ComponentLink1URL: http://www.ti.com/general/docs/lit/getliterature.tsp?genericPartNumber=LM1117-N&fileType=pdf; PinCount: 4; PackageReference: DCY0004A; ComponentLink1Description: Datasheet URL; PackageDescription: Molded SOT-223, 6.50 x 3.56 x 1.6mm Body, 4 Lead, 2.3mm Pitch; RoHS: Y